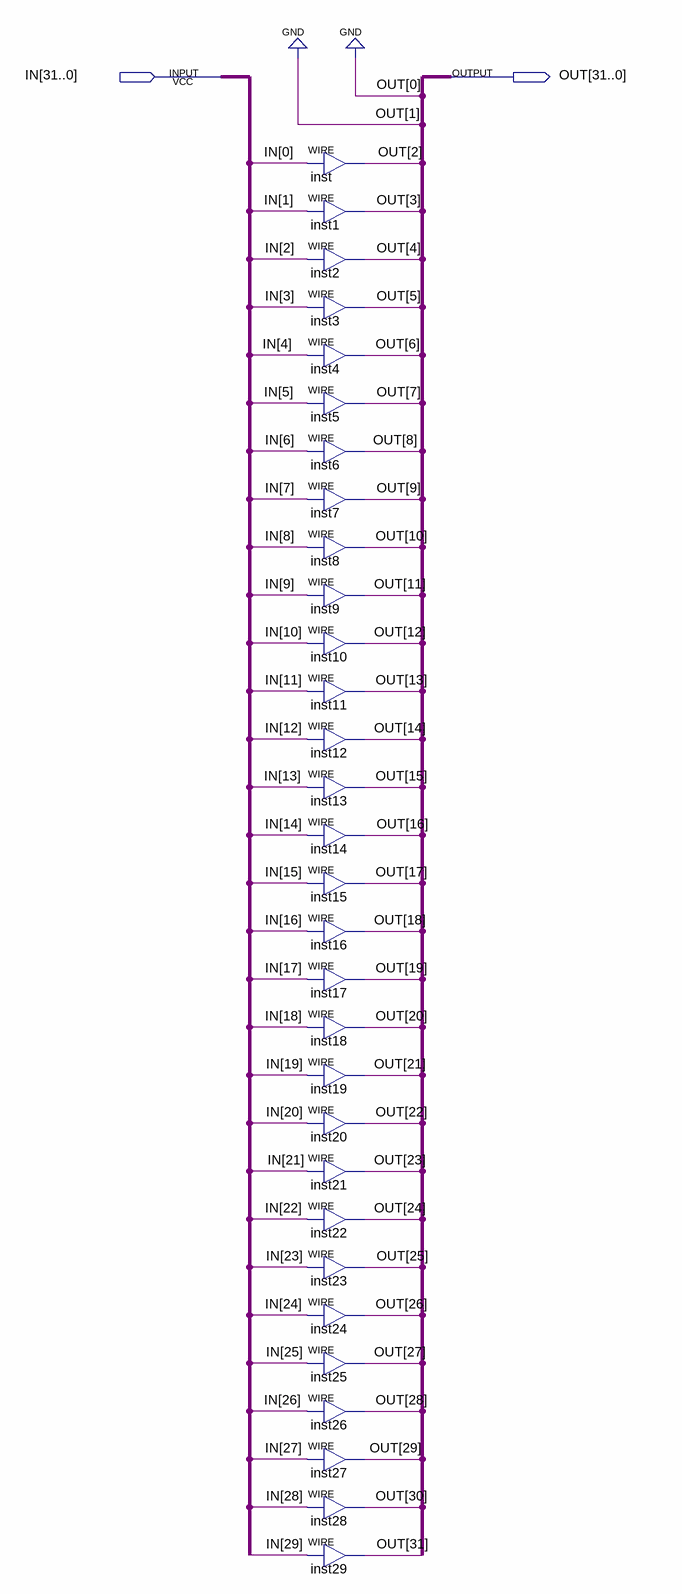
[diagram p0: schematic sheet]
// Quartus schematic shift_left2.bdf as structural Verilog: 30 symbols, 2 pins
module shift_left2 (
  input  [31:0] IN,
  output [31:0] OUT
);

  assign OUT[2] = IN[0];  // WIRE inst
  assign OUT[3] = IN[1];  // WIRE inst1
  assign OUT[4] = IN[2];  // WIRE inst2
  assign OUT[5] = IN[3];  // WIRE inst3
  assign OUT[6] = IN[4];  // WIRE inst4
  assign OUT[7] = IN[5];  // WIRE inst5
  assign OUT[8] = IN[6];  // WIRE inst6
  assign OUT[9] = IN[7];  // WIRE inst7
  assign OUT[10] = IN[8];  // WIRE inst8
  assign OUT[11] = IN[9];  // WIRE inst9
  assign OUT[12] = IN[10];  // WIRE inst10
  assign OUT[13] = IN[11];  // WIRE inst11
  assign OUT[14] = IN[12];  // WIRE inst12
  assign OUT[15] = IN[13];  // WIRE inst13
  assign OUT[16] = IN[14];  // WIRE inst14
  assign OUT[17] = IN[15];  // WIRE inst15
  assign OUT[18] = IN[16];  // WIRE inst16
  assign OUT[19] = IN[17];  // WIRE inst17
  assign OUT[20] = IN[18];  // WIRE inst18
  assign OUT[21] = IN[19];  // WIRE inst19
  assign OUT[22] = IN[20];  // WIRE inst20
  assign OUT[23] = IN[21];  // WIRE inst21
  assign OUT[24] = IN[22];  // WIRE inst22
  assign OUT[25] = IN[23];  // WIRE inst23
  assign OUT[26] = IN[24];  // WIRE inst24
  assign OUT[27] = IN[25];  // WIRE inst25
  assign OUT[28] = IN[26];  // WIRE inst26
  assign OUT[29] = IN[27];  // WIRE inst27
  assign OUT[30] = IN[28];  // WIRE inst28
  assign OUT[31] = IN[29];  // WIRE inst29

  assign OUT[1:0] = 2'b00;
endmodule
